# Altium schematic sheet Controller_Board_Interface.SchDoc
size Letter; DocumentNumber: 2; SheetNumber: 2; SheetTotal: 5; Website: www.uwmidsun.com
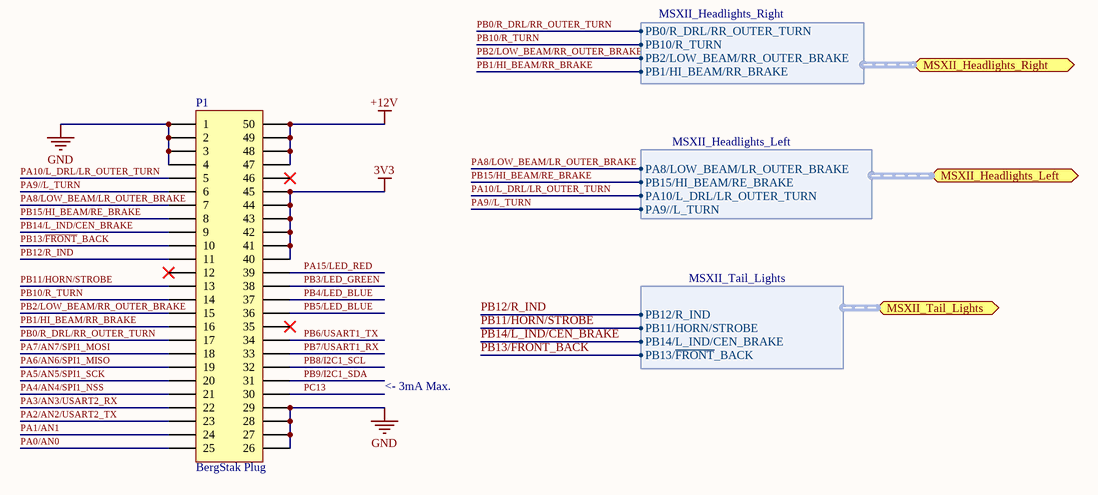
[diagram p0: Controller_Board_Interface.SchDoc]

## Parts
P1  Series: BergStak Plug  [CONN, Bergstak 50 Pos Plug]  (hidden comment: CONN 50POS Bergstak Plug 0.02")

## Ports
MSXII_Headlights_Left (harness MSXII_Headlights_Left), MSXII_Headlights_Right (harness MSXII_Headlights_Right), MSXII_Tail_Lights (harness MSXII_Tail_Lights)

## Harnesses
MSXII_Headlights_Right: PB0/R_DRL/RR_OUTER_TURN, PB10/R_TURN, PB2/LOW_BEAM/RR_OUTER_BRAKE, PB1/HI_BEAM/RR_BRAKE
MSXII_Headlights_Left: PA8/LOW_BEAM/LR_OUTER_BRAKE, PB15/HI_BEAM/RE_BRAKE, PA10/L_DRL/LR_OUTER_TURN, PA9//L_TURN
MSXII_Tail_Lights: PB14/L_IND/CEN_BRAKE, PB11/HORN/STROBE, PB12/R_IND, PB13/~{FRONT}_BACK

## Nets
3V3: P1.40 P1.41 P1.42 P1.43 P1.44 P1.45
+12V: P1.47 P1.48 P1.49 P1.50
GND: P1.1 P1.2 P1.3 P1.4 P1.26 P1.27 P1.28 P1.29
PA0/AN0: P1.25
PA1/AN1: P1.24
PA2/AN2/USART2_TX: P1.23
PA3/AN3/USART2_RX: P1.22
PA4/AN4/SPI1_NSS: P1.21
PA5/AN5/SPI1_SCK: P1.20
PA6/AN6/SPI1_MISO: P1.19
PA7/AN7/SPI1_MOSI: P1.18
PA8/LOW_BEAM/LR_OUTER_BRAKE: P1.7 ; port MSXII_Headlights_Left.PA8/LOW_BEAM/LR_OUTER_BRAKE
PA9//L_TURN: P1.6 ; port MSXII_Headlights_Left.PA9//L_TURN
PA10/L_DRL/LR_OUTER_TURN: P1.5 ; port MSXII_Headlights_Left.PA10/L_DRL/LR_OUTER_TURN
PA15/LED_RED: P1.39
PB0/R_DRL/RR_OUTER_TURN: P1.17 ; port MSXII_Headlights_Right.PB0/R_DRL/RR_OUTER_TURN
PB1/HI_BEAM/RR_BRAKE: P1.16 ; port MSXII_Headlights_Right.PB1/HI_BEAM/RR_BRAKE
PB2/LOW_BEAM/RR_OUTER_BRAKE: P1.15 ; port MSXII_Headlights_Right.PB2/LOW_BEAM/RR_OUTER_BRAKE
PB3/LED_GREEN: P1.38
PB4/LED_BLUE: P1.37
PB5/LED_BLUE: P1.36
PB6/USART1_TX: P1.34
PB7/USART1_RX: P1.33
PB8/I2C1_SCL: P1.32
PB9/I2C1_SDA: P1.31
PB10/R_TURN: P1.14 ; port MSXII_Headlights_Right.PB10/R_TURN
PB11/HORN/STROBE: P1.13 ; port MSXII_Tail_Lights.PB11/HORN/STROBE
PB12/R_IND: P1.11 ; port MSXII_Tail_Lights.PB12/R_IND
PB13/~{FRONT}_BACK: P1.10 ; port MSXII_Tail_Lights.PB13/~{FRONT}_BACK
PB14/L_IND/CEN_BRAKE: P1.9 ; port MSXII_Tail_Lights.PB14/L_IND/CEN_BRAKE
PB15/HI_BEAM/RE_BRAKE: P1.8 ; port MSXII_Headlights_Left.PB15/HI_BEAM/RE_BRAKE
PC13: P1.30

Not connected (* = marked no-connect by the designer): P1 12* 35* 46*

## Notes on the sheet
- <- 3mA Max.
- Project:
- Title:
- Size:
- Project Lead:
- Letter
- Revision:
- University of Waterloo
- 200 University Ave W
- Waterloo, ON, Canada
- N2L 3E9
- Date:
- Sheet
- of
- Website:

## Library data of the parts
P1 = CONN 50POS Bergstak Plug 0.02": 50 Position Connector Plug, Outer Shroud Contacts Surface Mount Gold; Manufacturer 1: Amphenol FCI; Manufacturer Part Number 1: 10132797-055100LF; Number of Positions: 50; Mated Stacking Heights: 5mm; Pitch: 0.020" (0.50mm); Supplier 1: Digi-Key; Supplier Part Number 1: 609-5226-1-ND; Packaging: Cut Tape (CT); Part Status: Active; Connector Type: Plug, Outer Shroud Contacts; Number of Rows: 2; Mounting Type: Surface Mount; Contact Finish: Gold; Contact Finish Thickness: 1µin (0.025µm); Height Above Board: 0.169" (4.30mm); ComponentLink1URL: http://portal.fciconnect.com/Comergent//fci/drawing/10132797.pdf; ComponentLink1Description: http://portal.fciconnect.com/Comergent//fci/drawing/10132797.pdf